# Altium schematic sheet DC-DC_5V0_To_3V3.SchDoc
size A4; SheetNumber: 2; SheetTotal: 11
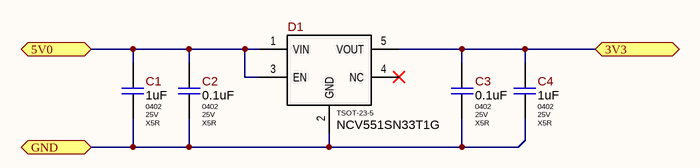
[diagram p0: DC-DC_5V0_To_3V3.SchDoc]

## Parts
C1  Package: 0402  Voltage: 25V  Dielectric Type: X5R  [C_CERAMIC_0402_MED]  (hidden comment: 1uF)
C2  Package: 0402  Voltage: 25V  Dielectric Type: X5R  [C_CERAMIC_0402_MED]  (hidden comment: 0.1uF)
C3  Package: 0402  Voltage: 25V  Dielectric Type: X5R  [C_CERAMIC_0402_MED]  (hidden comment: 0.1uF)
C4  Package: 0402  Voltage: 25V  Dielectric Type: X5R  [C_CERAMIC_0402_MED]  (hidden comment: 1uF)
D1  NCV551SN33T1G  [TSOT-23-5]

## Ports
3V3 (bidir, see UI[2C], MCU_STM32L010K4T6[1A], MCU_STM32L010K4T6[1C], MCU_STM32L010K4T6[2C], MCU_STM32L010K4T6[4A], MCU_STM32L010K4T6[4B]), 5V0 (bidir, see UI[2C], DC-DC_24V_To_5V0[4B]), GND (bidir, see UI[2C], DC-DC_24V_To_5V0[1C], MCU_STM32L010K4T6[3B], MCU_STM32L010K4T6[4B])

## Nets
3V3: C3.1 C4.1 D1.5(VOUT) ; port 3V3
5V0: C1.1 C2.1 D1.1(VIN) D1.3(EN) ; port 5V0
GND: C1.2 C2.2 C3.2 C4.2 D1.2(GND) ; port GND

Not connected (* = marked no-connect by the designer): D1 4(NC)*

## Library data of the parts
C1 = Capacitor-NonPolar: 1uF 25V Х5R ±10% 0402 Ceramic Capacitor RoHS; Part Number: GRM155R61E105KA12D; Manufacturer: Murata Electronics; Standard Lead Time: 15 Weeks; Component Status: Released; Replacement: NONE; Value: 1uF; Part Type: Ceramic / X5R / 0402; Component Type: SMD; Temperature Range: -55°C ~ 85°C; Tolerance: ±10%; ComponentLink1URL: https://search.murata.co.jp/Ceramy/image/img/A01X/G101/ENG/GRM155R61E105KA12-01.pdf; Supplier 1: Digi-Key; Supplier Part Number 1: 490-10017-1-ND; Price: 0.0033; ComponentLink1Description: Datasheet
C2 C3 = Capacitor-NonPolar: 100nF 25V X5R ±10% 0402 Ceramic Capacitor RoHS; Part Number: CL05A104KA5NNNC; Manufacturer: Samsung Electro-Mechanics; Ajax_1C_ID: 27170; Ajax_1C_PN: 100nF 25V X5R 10% 0402 CL05A104KA5NNNC Ceramic Capacitor SMD RoHS; Standard Lead Time: 38 Weeks; Replacement: NONE; Ajax_1С_Status: Mass Production; Component Status: Released; GUID_1C: 6c9121f0-7733-11eb-ab70-0050569f2651; Value: 0.1uF; Part Type: Ceramic / X5R / 0402; Component Type: SMD; Temperature Range: -55°C ~ 85°C; Tolerance: ±10%; ComponentLink1URL: https://eu.mouser.com/datasheet/2/585/MLCC-1837944.pdf; Supplier 1: Mouser; Supplier Part Number 1: 187-CL05A104KA5NNNC; ComponentLink1Description: Datasheet; Price: 0.0013
C4 = Capacitor-NonPolar: 1uF 25V Х5R ±10% 0402 Ceramic Capacitor RoHS; Part Number: GRM155R61E105KA12D; Manufacturer: Murata Electronics; Ajax_1C_ID: 20895; Ajax_1C_PN: 1uF 25V Х5R 10% 0402 GRM155R61E105KA12D Murata Ceramic Capacitor SMD RoHS; Ajax_1С_Status: Mass Production; Standard Lead Time: 15 Weeks; Component Status: Released; Replacement: NONE; GUID_1C: a74143f5-b173-11ea-ab61-0050569f2651; Value: 1uF; Part Type: Ceramic / X5R / 0402; Component Type: SMD; Temperature Range: -55°C ~ 85°C; Tolerance: ±10%; ComponentLink1URL: https://search.murata.co.jp/Ceramy/image/img/A01X/G101/ENG/GRM155R61E105KA12-01.pdf; Supplier 1: Digi-Key; Supplier Part Number 1: 490-10017-1-ND; Price: 0.0033; ComponentLink1Description: Datasheet
D1 = NCV551SNxxT1G: Fixed 3.3V, 150mA Output, 12V max Input, 4uA Iq, LDO, TSOT-23-5; Manufacturer: Onsemi; Standard Lead Time: 53 Weeks; Component Status: Released; Replacement: NONE; Package: TSOT-23-5; Part Number: NCV551SN33T1G; Part Type: Power / Linear Regulator; Component Type: SMD; Temperature Range: -40°C ~ 125°C; ComponentLink1URL: https://eu.mouser.com/datasheet/2/308/NCP551_D-1812664.pdf; Supplier 1: Mouser; Supplier Part Number 1: 863-NCV551SN33T1G; Price: 0.23211881; ComponentLink1Description: Datasheet